# Altium schematic sheet Main.SchDoc
size A; SheetNumber: 1; SheetTotal: 6
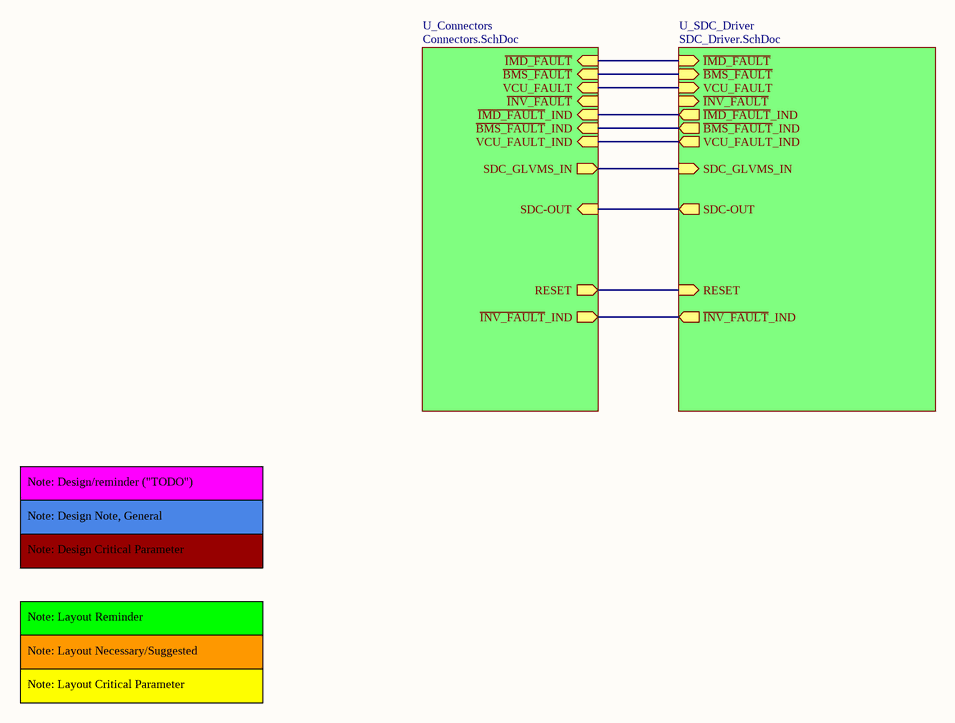
[diagram p0: Main.SchDoc]

## Sub-sheets
U_Connectors = Connectors.SchDoc: ~{IMD_FAULT} (in), ~{BMS_FAULT} (in), VCU_FAULT (in), ~{IMD_FAULT}_IND (in), ~{BMS_FAULT}_IND (in), VCU_FAULT_IND (in), SDC-OUT (in), SDC_GLVMS_IN (out), RESET (out), ~{INV_FAULT} (in), ~{INV_FAULT}_IND (out)
U_SDC_Driver = SDC_Driver.SchDoc: SDC_GLVMS_IN (in), RESET (in), SDC-OUT (out), ~{IMD_FAULT} (in), ~{BMS_FAULT} (in), VCU_FAULT (in), ~{IMD_FAULT}_IND (out), ~{BMS_FAULT}_IND (out), VCU_FAULT_IND (out), ~{INV_FAULT} (in), ~{INV_FAULT}_IND (out)

## Nets
(unnamed): sheet U_Connectors/~{IMD_FAULT}, sheet U_SDC_Driver/~{IMD_FAULT}
(unnamed): sheet U_Connectors/~{BMS_FAULT}, sheet U_SDC_Driver/~{BMS_FAULT}
(unnamed): sheet U_Connectors/VCU_FAULT, sheet U_SDC_Driver/VCU_FAULT
(unnamed): sheet U_Connectors/~{IMD_FAULT}_IND, sheet U_SDC_Driver/~{IMD_FAULT}_IND
(unnamed): sheet U_Connectors/~{BMS_FAULT}_IND, sheet U_SDC_Driver/~{BMS_FAULT}_IND
(unnamed): sheet U_Connectors/VCU_FAULT_IND, sheet U_SDC_Driver/VCU_FAULT_IND
(unnamed): sheet U_Connectors/SDC-OUT, sheet U_SDC_Driver/SDC-OUT
(unnamed): sheet U_Connectors/SDC_GLVMS_IN, sheet U_SDC_Driver/SDC_GLVMS_IN
(unnamed): sheet U_Connectors/RESET, sheet U_SDC_Driver/RESET
(unnamed): sheet U_Connectors/~{INV_FAULT}_IND, sheet U_SDC_Driver/~{INV_FAULT}_IND

## Notes on the sheet
- Note: Design/reminder ("TODO")
- Note: Design Note, General
- Note: Design Critical Parameter
- Note: Layout Reminder
- Note: Layout Necessary/Suggested
- Note: Layout Critical Parameter